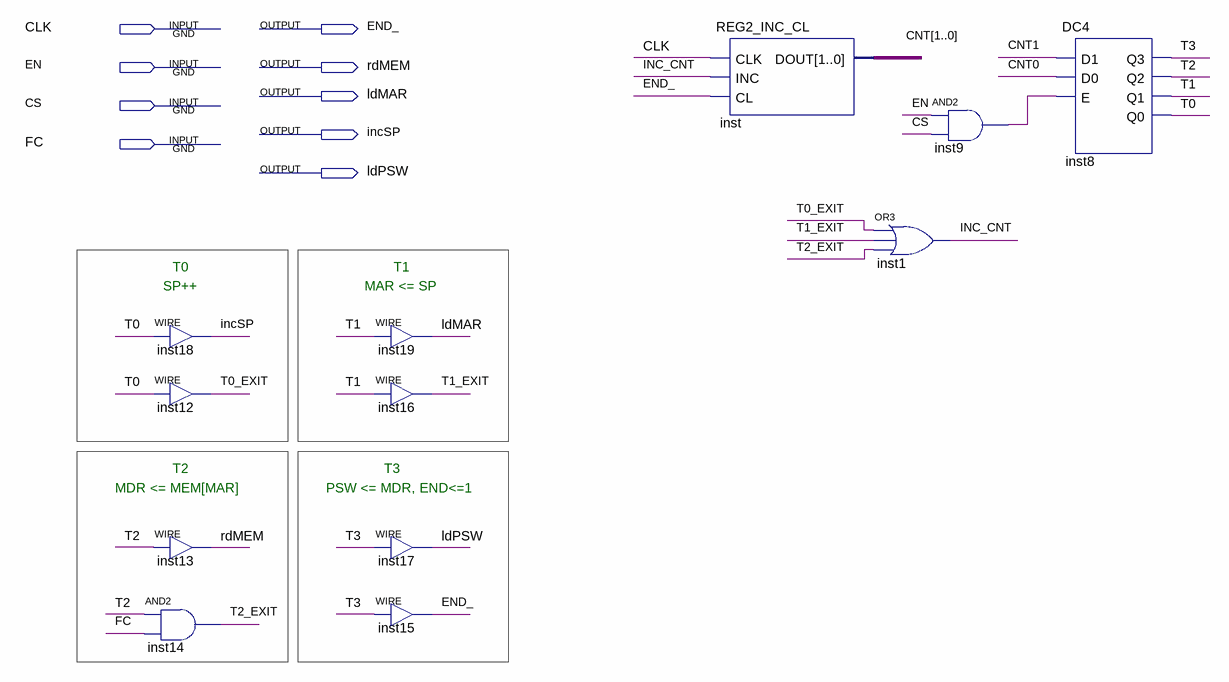
[diagram p0: schematic sheet]
// Quartus schematic PLP.bdf as structural Verilog: 12 symbols, 9 pins
module PLP (
  input  CLK,
  input  EN,
  input  CS,
  input  FC,
  output END_,
  output rdMEM,
  output ldMAR,
  output incSP,
  output ldPSW
);

  wire INC_CNT, inst9_out, T0, T0_EXIT, T1, T1_EXIT, T2, T2_EXIT, T3;
  wire [1:0] CNT;

  assign incSP = T0;  // WIRE inst18
  assign T0_EXIT = T0;  // WIRE inst12
  assign rdMEM = T2;  // WIRE inst13
  and inst14 (T2_EXIT, T2, FC);
  assign ldMAR = T1;  // WIRE inst19
  assign T1_EXIT = T1;  // WIRE inst16
  assign ldPSW = T3;  // WIRE inst17
  assign END_ = T3;  // WIRE inst15
  REG2_INC_CL inst (.CLK(CLK), .INC(INC_CNT), .CL(END_), .DOUT(CNT));
  and inst9 (inst9_out, EN, CS);
  or inst1 (INC_CNT, T0_EXIT, T1_EXIT, T2_EXIT);
  DC4 inst8 (.D1(CNT[1]), .D0(CNT[0]), .E(inst9_out), .Q3(T3), .Q2(T2), .Q1(T1), .Q0(T0));

  // Notes on the sheet:
  //   T0
  //   T1
  //   SP++
  //   MAR <= SP
  //   T2
  //   T3
  //   MDR <= MEM[MAR] 
  //   PSW <= MDR, END<=1
endmodule
